# EAGLE design M113 (EAGLE 6.6.0)
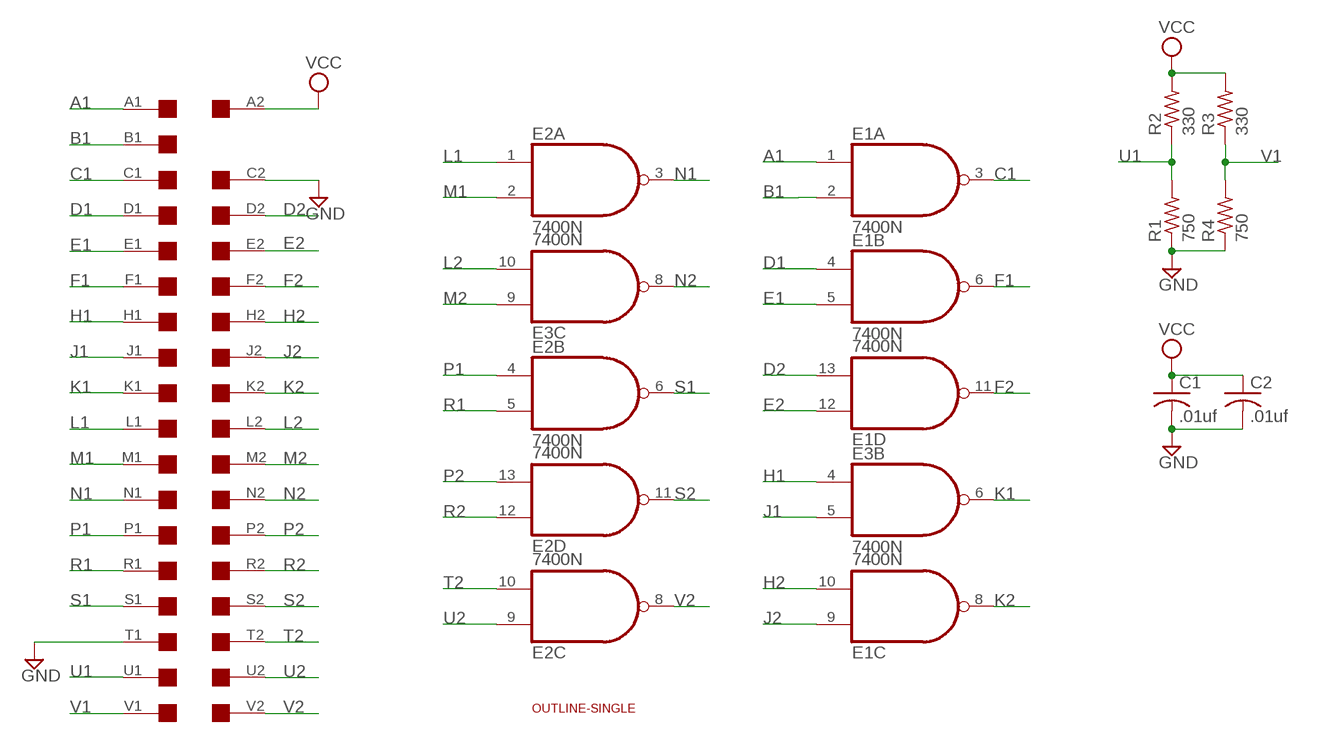
[diagram p0: schematic, sheet 1]

## Parts
C1  .01uf  C-US050-025X075  [C050-025X075]
C2  .01uf  C-US050-025X075  [C050-025X075]
E1  7400N  [DIL14]
E2  7400N  [DIL14]
E3  7400N  [DIL14]
R1  750  R-US_0207/10  [0207/10]
R2  330  R-US_0207/10  [0207/10]
R3  330  R-US_0207/10  [0207/10]
R4  750  R-US_0207/10  [0207/10]
U$1  SINGLE  [EDGE-CON2]
U$2  OUTLINE-SINGLE  [SINGLE]

## Nets
A1: E1.1(A:I0) U$1.A1
B1: E1.2(A:I1) U$1.B1
C1: E1.3(A:O) U$1.C1
D1: E1.4(B:I0) U$1.D1
D2: E1.13(D:I1) U$1.D2
E1: E1.5(B:I1) U$1.E1
E2: E1.12(D:I0) U$1.E2
F1: E1.6(B:O) U$1.F1
F2: E1.11(D:O) U$1.F2
GND: C1.2 C2.2 R1.1 R4.1 U$1.C2 U$1.T1
H1: E3.4(B:I0) U$1.H1
H2: E1.10(C:I1) U$1.H2
J1: E3.5(B:I1) U$1.J1
J2: E1.9(C:I0) U$1.J2
K1: E3.6(B:O) U$1.K1
K2: E1.8(C:O) U$1.K2
L1: E2.1(A:I0) U$1.L1
L2: E3.10(C:I1) U$1.L2
M1: E2.2(A:I1) U$1.M1
M2: E3.9(C:I0) U$1.M2
N1: E2.3(A:O) U$1.N1
N2: E3.8(C:O) U$1.N2
P1: E2.4(B:I0) U$1.P1
P2: E2.13(D:I1) U$1.P2
R1: E2.5(B:I1) U$1.R1
R2: E2.12(D:I0) U$1.R2
S1: E2.6(B:O) U$1.S1
S2: E2.11(D:O) U$1.S2
T2: E2.10(C:I1) U$1.T2
U1: R1.2 R2.1 U$1.U1
U2: E2.9(C:I0) U$1.U2
V1: R3.1 R4.2 U$1.V1
V2: E2.8(C:O) U$1.V2
VCC: C1.1 C2.1 R2.2 R3.2 U$1.A2
Unconnected: E3.1(A:I0) E3.2(A:I1) E3.3(A:O) E3.11(D:O) E3.12(D:I0) E3.13(D:I1) U$1.B2

## Power pins joined to a net without a drawn wire
GND: E1.7(P:GND) E2.7(P:GND) E3.7(P:GND)
VCC: E1.14(P:VCC) E2.14(P:VCC) E3.14(P:VCC)

## Library data of the parts
C1 C2 = rcl:C-US: CAPACITOR, American symbol
E1-E3 = 74xx-us:74*00: Quad 2-input NAND gate
R1-R4 = rcl:R-US_: RESISTOR, American symbol
U$1 = dec-con:SINGLE: Single-Height DEC board
U$2 = dec-con:OUTLINE-*: Board outlines for DEC boards.

## Board
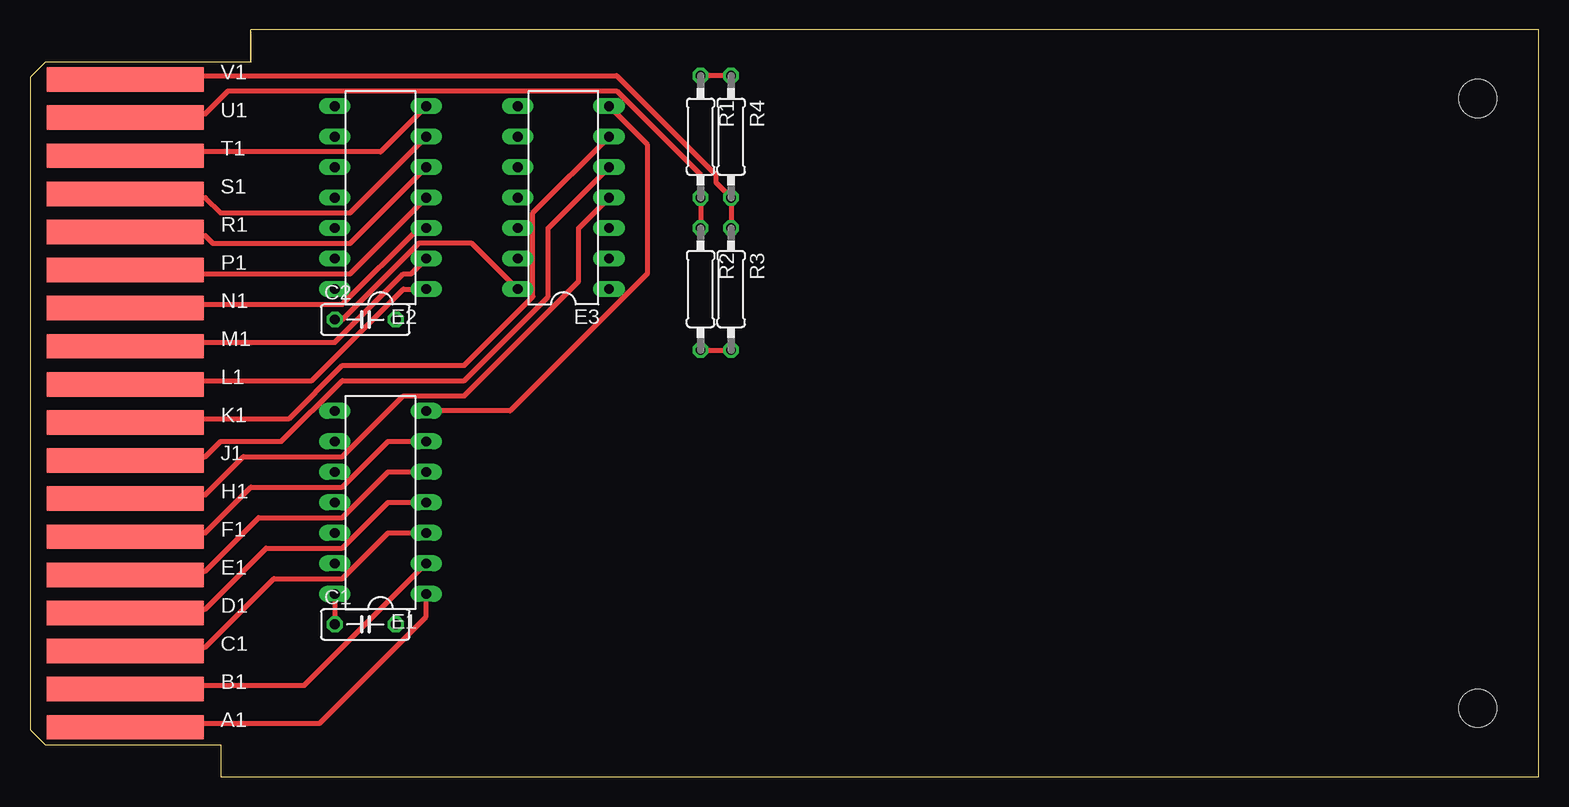
[diagram p1: board, top side]
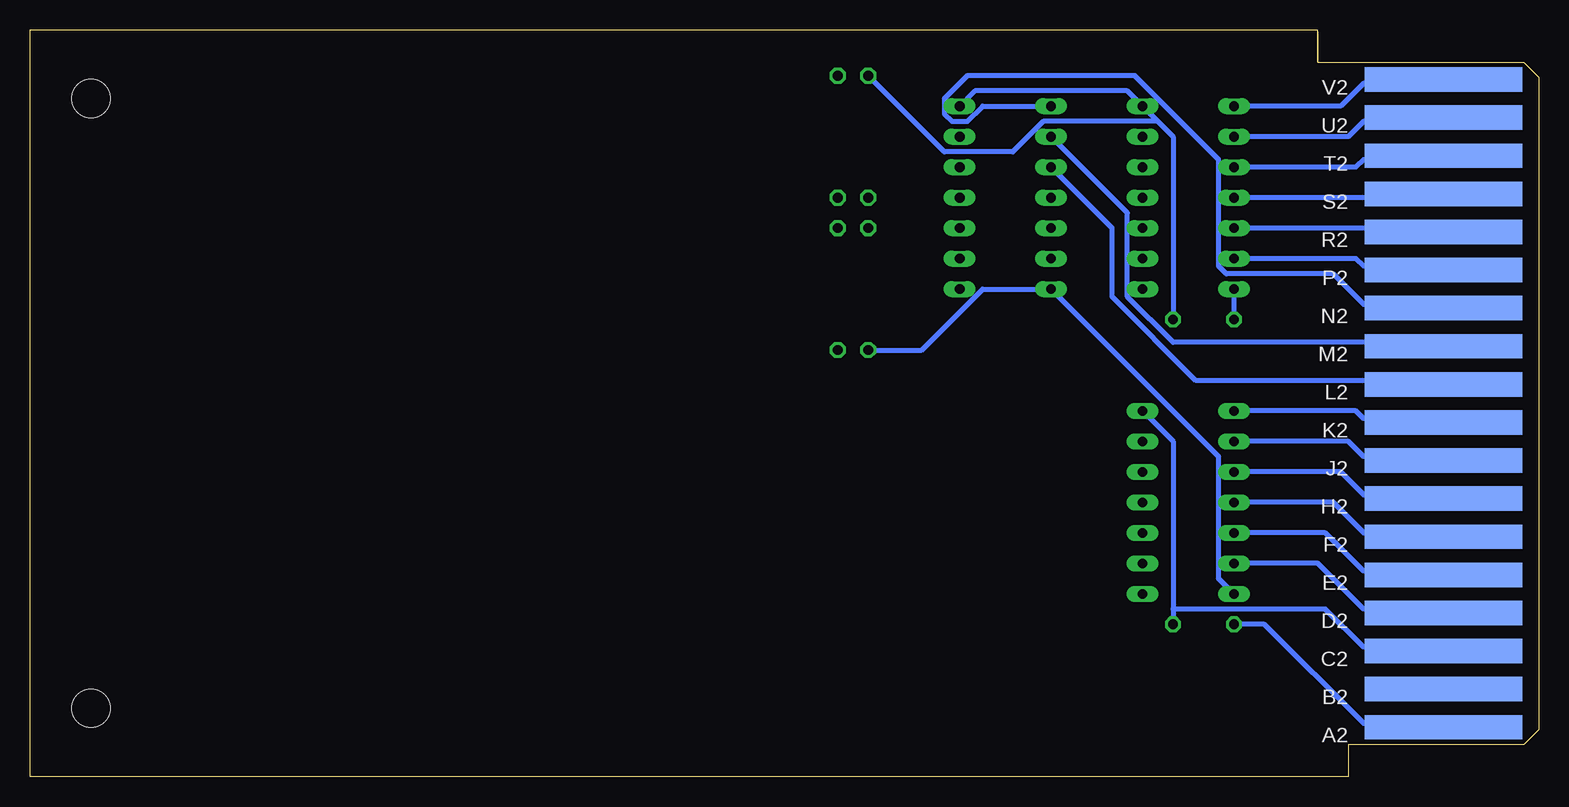
[diagram p2: board, bottom side, seen from below]

Size 125.73 x 62.23 mm. Coordinates in mm from the lower left corner, seen from the top.
Copper layers (1+16): Top 0.035mm / dielectric 1.5mm / Bottom 0.035mm
Design rules "16mils": minimum track width 16mil, minimum drill 32mil, track to track 15mil, track to pad 10mil, pad to pad 10mil, via to via 10mil, smd to smd 10mil, copper to edge 13mil, drill to drill 10mil, minimum pad ring 10mil, minimum via ring 8mil, stop-mask expansion 0mil, vias tented up to drill 0mil, thermal gap 10mil

### Footprints (pad centres in the part's own frame; a part is rotated, then mirrored left to right if it is on the bottom)
C050-025X075 = drill 0.813 octagon: 1 -2.54,0; 2 2.54,0
DIL14 = drill 0.813 long: 1 -7.62,-3.81; 2 -5.08,-3.81; 3 -2.54,-3.81; 4 0,-3.81; 5 2.54,-3.81; 6 5.08,-3.81; 7 7.62,-3.81; 8 7.62,3.81; 9 5.08,3.81; 10 2.54,3.81; 11 0,3.81; 12 -2.54,3.81; 13 -5.08,3.81; 14 -7.62,3.81
0207/10 = drill 0.813 octagon: 1 -5.08,0; 2 5.08,0
EDGE-CON2 = smd 13.106 x 2.032: A1 7.938,4.128; B1 7.938,7.303; C1 7.938,10.477; D1 7.938,13.652; E1 7.938,16.828; F1 7.938,20.003; H1 7.938,23.177; J1 7.938,26.352; K1 7.938,29.527; L1 7.938,32.703; M1 7.938,35.877; N1 7.938,39.053; P1 7.938,42.227; R1 7.938,45.403; S1 7.938,48.578; T1 7.938,51.752; U1 7.938,54.928; V1 7.938,58.102 | smd 13.106 x 2.032 bottom: A2 7.938,4.128; B2 7.938,7.303; C2 7.938,10.477; D2 7.938,13.652; E2 7.938,16.828; F2 7.938,20.003; H2 7.938,23.177; J2 7.938,26.352; K2 7.938,29.527; L2 7.938,32.703; M2 7.938,35.877; N2 7.938,39.053; P2 7.938,42.227; R2 7.938,45.403; S2 7.938,48.578; T2 7.938,51.752; U2 7.938,54.928; V2 7.938,58.102
SINGLE = hole 3.175: 120.65,56.515; 120.65,5.715

### Placement (x,y rotation side)
C1  27.94,12.7 0 top
C2  27.94,38.1 0 top
E1  29.21,22.86 90 top
E2  29.21,48.26 90 top
E3  44.45,48.26 90 top
R1  55.88,53.34 270 top
R2  55.88,40.64 270 top
R3  58.42,40.64 270 top
R4  58.42,53.34 270 top
U$1  0,0 0 top
U$2  0,0 0 top

### Tracks (layer width: path | path; a pad name or v marks a point on that pad's centre or on a via)
A1
  Top 0.406: E1.1 33.02,13.34 24.13,4.45 8.26,4.45 U$1.A1
B1
  Top 0.406: E1.2 22.86,7.62 8.26,7.62 U$1.B1
C1
  Top 0.406: E1.3 29.85,20.32 26.04,16.51 20.32,16.51 14.61,10.79 8.26,10.79 U$1.C1
D1
  Top 0.406: E1.4 29.85,22.86 26.04,19.05 19.69,19.05 14.61,13.97 8.26,13.97 U$1.D1
D2
  Bottom 0.406: E1.13 18.42,17.78 14.61,13.97 8.26,13.97 U$1.D2
E1
  Top 0.406: E1.5 29.85,25.4 26.04,21.59 19.05,21.59 14.61,17.14 8.26,17.14 U$1.E1
E2
  Bottom 0.406: E1.12 17.78,20.32 14.61,17.14 8.26,17.14 U$1.E2
F1
  Top 0.406: E1.6 29.85,27.94 26.04,24.13 18.42,24.13 14.61,20.32 8.26,20.32 U$1.F1
F2
  Bottom 0.406: E1.11 17.15,22.86 14.61,20.32 8.26,20.32 U$1.F2
GND
  Top 0.406: R4.1 R1.1 | E2.7 29.21,52.07 8.26,52.07 U$1.T1 | E1.7 40.01,30.48 51.44,41.91 51.44,52.7 E3.7
  Bottom 0.406: 30.48,13.97 30.48,27.94 E1.7 | 30.48,13.97 C1.2 | 30.48,13.97 17.78,13.97 14.61,10.79 8.26,10.79 U$1.C2 | C2.2 30.48,53.34 31.75,54.61 | 31.75,54.61 E2.7 34.29,57.15 46.99,57.15 E3.7 | R1.1 49.53,52.07 43.82,52.07 41.28,54.61 31.75,54.61
H1
  Top 0.406: E3.4 45.72,45.72 45.72,41.27 36.2,31.75 31.12,31.75 26.04,26.67 17.78,26.67 14.61,23.5 8.26,23.5 U$1.H1
H2
  Bottom 0.406: E1.10 16.51,25.4 14.61,23.5 8.26,23.5 U$1.H2
J1
  Top 0.406: E3.5 43.18,45.72 43.18,40.01 36.2,33.02 26.04,33.02 20.96,27.94 15.88,27.94 14.61,26.67 8.26,26.67 U$1.J1
J2
  Bottom 0.406: E1.9 15.88,27.94 14.61,26.67 8.26,26.67 U$1.J2
K1
  Top 0.406: E3.6 41.91,46.99 41.91,40.01 36.2,34.29 26.04,34.29 21.59,29.84 8.26,29.84 U$1.K1
K2
  Bottom 0.406: E1.8 15.24,30.48 14.61,29.84 8.26,29.84 U$1.K2
L1
  Top 0.406: E2.1 31.12,40.64 23.5,33.02 8.26,33.02 U$1.L1
L2
  Bottom 0.406: E3.10 35.56,45.72 35.56,40.01 28.58,33.02 8.26,33.02 U$1.L2
M1
  Top 0.406: E2.2 31.75,41.91 31.12,41.91 25.4,36.2 8.26,36.2 U$1.M1
M2
  Bottom 0.406: E3.9 34.29,46.99 34.29,40.01 30.48,36.2 8.26,36.2 U$1.M2
N1
  Top 0.406: E2.3 32.39,45.72 26.04,39.37 8.26,39.37 U$1.N1
N2
  Bottom 0.406: E3.8 46.36,55.88 47.63,54.61 48.9,54.61 49.53,55.24 49.53,56.52 47.63,58.42 33.66,58.42 26.67,51.44 26.67,42.55 26.04,41.91 17.15,41.91 14.61,39.37 8.26,39.37 U$1.N2
P1
  Top 0.406: E2.4 26.67,41.91 8.26,41.91 U$1.P1
P2
  Bottom 0.406: E2.13 15.24,43.18 14.61,42.55 8.26,42.55 U$1.P2
R1
  Top 0.406: E2.5 26.67,44.45 15.24,44.45 14.61,45.09 8.26,45.09 U$1.R1
R2
  Bottom 0.406: E2.12 8.26,45.72 U$1.R2
S1
  Top 0.406: E2.6 26.67,46.99 15.88,46.99 14.61,48.26 8.26,48.26 U$1.S1
S2
  Bottom 0.406: E2.11 8.26,48.26 U$1.S2
T2
  Bottom 0.406: E2.10 15.24,50.8 14.61,51.44 8.26,51.44 U$1.T2
U1
  Top 0.406: R2.1 R1.2 55.88,50.16 48.9,57.15 16.51,57.15 14.61,55.24 8.26,55.24 U$1.U1
U2
  Bottom 0.406: E2.9 15.88,53.34 14.61,54.61 8.26,54.61 U$1.U2
V1
  Top 0.406: R3.1 R4.2 57.15,49.53 57.15,50.16 48.9,58.42 8.26,58.42 U$1.V1
V2
  Bottom 0.406: E2.8 16.51,55.88 14.61,57.78 8.26,57.78 U$1.V2
VCC
  Top 0.406: R2.2 R3.2 | C2.1 26.04,38.1 32.39,44.45 36.83,44.45 E3.14 | E1.14 C1.1
  Bottom 0.406: E2.14 C2.1 | R2.2 51.44,35.56 46.36,40.64 E3.14 26.67,26.67 26.67,16.51 E1.14 | C1.1 22.86,12.7 14.61,4.45 8.26,4.45 U$1.A2